# EAGLE design WN01 (EAGLE 6.3)
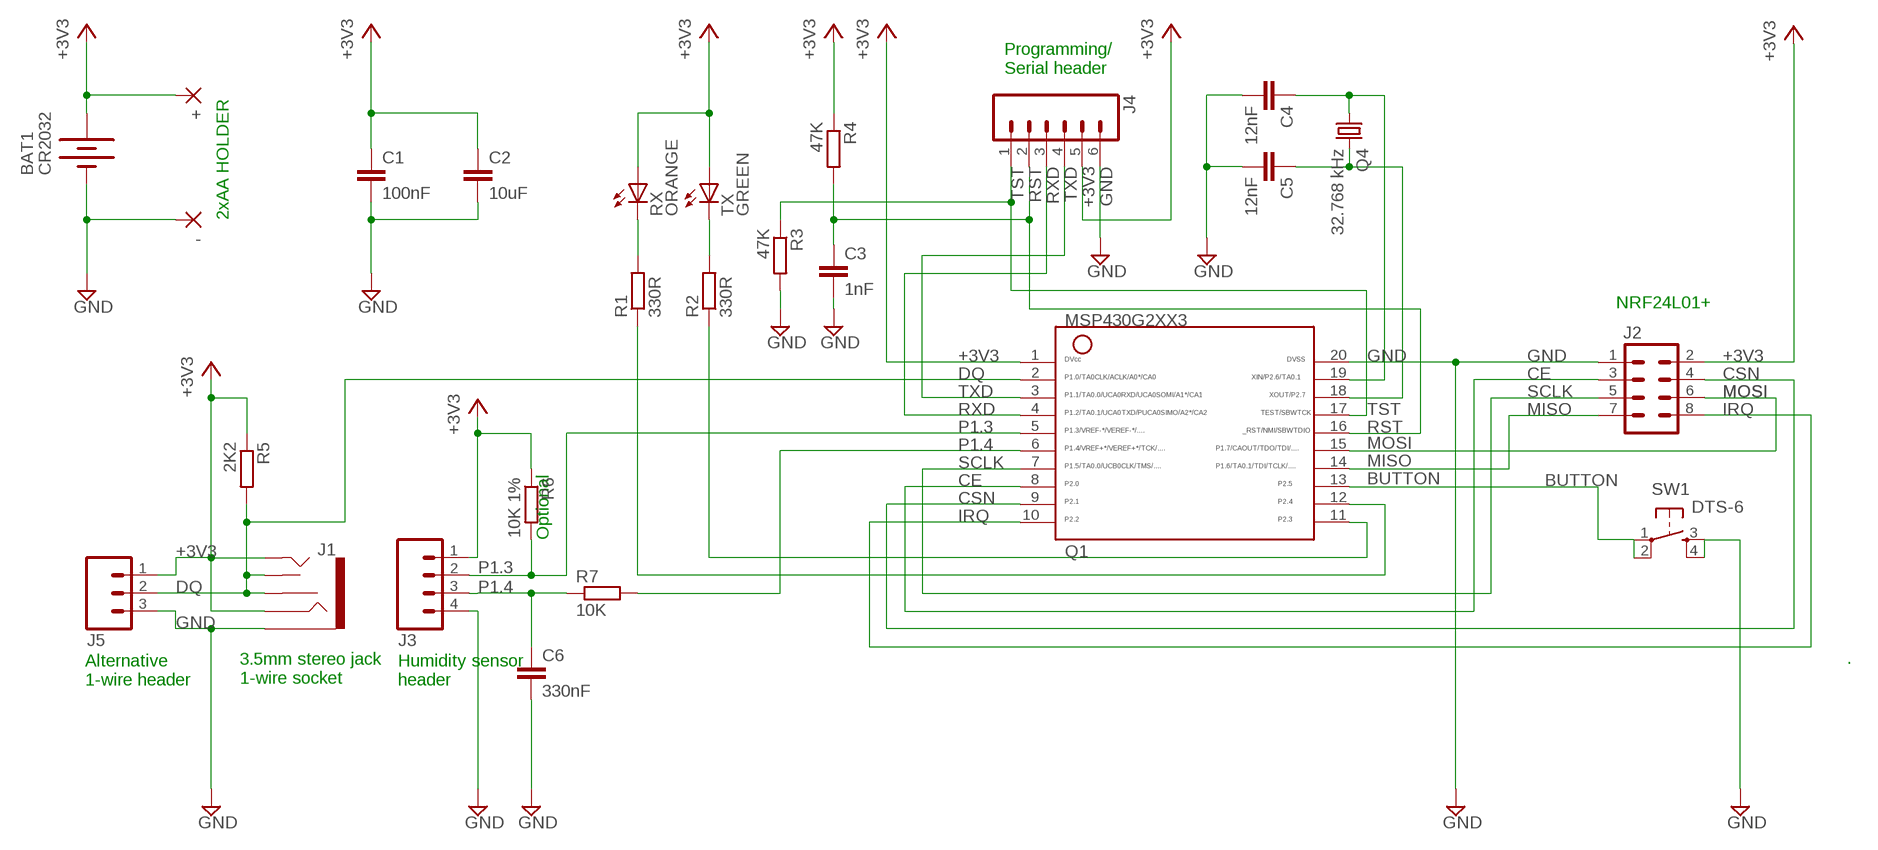
[diagram p0: schematic, sheet 1]

## Parts
+  2,54/1,0  [2,54/1,0]
-  2,54/1,0  [2,54/1,0]
BAT1  CR2032  BATTERY20PTH  [BATTCOM_20MM_PTH]
C1  100nF  C-EUC0805  [C0805]
C2  10uF  C-EUC1206  [C1206]
C3  1nF  C-EUC0805  [C0805]
C4  12nF  C-EUC0805  [C0805]
C5  12nF  C-EUC0805  [C0805]
C6  330nF  C-EUC0805  [C0805]
J1  AUDIO-JACK2PTH  [AUDIO-JACK]
J2  M04X2  [2X4]
J3  M04PTH  [1X04]
J4  M06SIP  [1X06]
J5  M03PTH  [1X03]
Q1  G2XX3---PW20  [PW20]
Q4  32.768 kHz  CRYSTALTC38H  [TC38H]
R1  330R  R-EU_M0805  [M0805]
R2  330R  R-EU_M0805  [M0805]
R3  47K  R-EU_M0805  [M0805]
R4  47K  R-EU_M0805  [M0805]
R5  2K2  R-EU_M0805  [M0805]
R6  10K 1%  R-EU_M0805  [M0805]
R7  10K  R-EU_M0805  [M0805]
RX  ORANGE  LEDCHIPLED_0805  [CHIPLED_0805]
SW1  DTS-6  [DTS-6]
TX  GREEN  LEDCHIPLED_0805  [CHIPLED_0805]

## Nets
+3V3: +.1(P) BAT1.1(+) C1.1 C2.1 J1.RING J1.TIP J2.2 J3.1 J4.5 J5.1 Q1.1 R4.1 R5.1 R6.1 RX.A TX.A
BUTTON: Q1.13 SW1.1 SW1.2
CE: J2.3 Q1.8
CSN: J2.4 Q1.9
DQ: J1.RSH J1.TSH J5.2 Q1.2 R5.2
GND: -.1(P) BAT1.2(-) C1.2 C2.2 C3.2 C4.2 C5.2 C6.2 J1.SLEEVE J2.1 J3.4 J4.6 J5.3 Q1.20 R3.2 SW1.3 SW1.4
IRQ: J2.8 Q1.10
MISO: J2.7 Q1.14
MOSI: J2.6 Q1.15
N$1: R2.2 TX.C
N$2: R1.2 RX.C
N$3: Q1.11 R2.1
N$5: Q1.12 R1.1
N$7: C6.1 J3.3 R7.1
P1.3: J3.2 Q1.5 R6.2
P1.4: Q1.6 R7.2
P2.6: C4.1 Q1.19 Q4.1
P2.7: C5.1 Q1.18 Q4.2
RST: C3.1 J4.2 Q1.16 R4.2
RXD: J4.3 Q1.4
SCLK: J2.5 Q1.7
TST: J4.1 Q1.17 R3.1
TXD: J4.4 Q1.3

## Notes on the sheet
- Programming/
  Serial header
- 2xAA HOLDER
- NRF24L01+
- Optional
- .
- 3.5mm stereo jack
  1-wire socket
- Alternative
  1-wire header
- Humidity sensor 
  header

## Library data of the parts
+ - = wirepad:2,54/1,0: THROUGH-HOLE PAD
BAT1 = SparkFun:BATTERY: Battery Holders Various common sizes : AA, AAA, 20mm coin cell and 12mm coin cell.
C1 C3-C6 = resistor:C-EU: CAPACITOR, European symbol
C2 = rcl:C-EU: CAPACITOR, European symbol
J1 = SparkFun-Connectors:AUDIO-JACK2: Stereo audio jack with bypass switches.
J2 = SparkFun:M04X2
J3 = SparkFun:M04: Header 4 Standard 4-pin 0.1" header. Use with straight break away headers (SKU : PRT-00116), right angle break away headers (PRT-00553), swiss pins (PRT-00743), machine pins (PRT-00117), and female headers (PRT-00115). Molex polarized connector foot print use with SKU : PRT-08231 with associated crimp pins and housings. 1MM SMD Version SKU: PRT-10208
J4 = SparkFun:M06: Header 6 Standard 6-pin 0.1" header. Use with straight break away headers (SKU : PRT-00116), right angle break away headers (PRT-00553), swiss pins (PRT-00743), machine pins (PRT-00117), and female headers (PRT-00115). Molex polarized connector foot print use with SKU : PRT-08094 with associated crimp pins and housings. NOTES ON THE VARIANTS LOCK and LOCK_LONGPADS... This footprint was designed to help hold the alignment of a through-hole component (i.e. 6-pin header) while soldering it into place. You may notice that each hole has been shifted either up or down by 0.005 of an inch from it's more standard position (which is a perfectly straight line). This slight alteration caused the pins (the squares in the middle) to touch the edges of the holes. Because they are alternating, it causes a "brace" to hold the component in place. 0.005 has proven to be the perfect amount of "off-center" position when using our standard breakaway headers. Although looks a little odd when you look at the bare footprint, once you have a header in there, the alteration is very hard to notice. Also, if you push a header all the way into place, it is covered up entirely on the bottom side. This idea of altering the position of holes to aid alignment will be further integrated into the Sparkfun Library for other footprints. It can help hold any component with 3 or more connection pins.
J5 = SparkFun:M03: Header 3 Standard 3-pin 0.1" header. Use with straight break away headers (SKU : PRT-00116), right angle break away headers (PRT-00553), swiss pins (PRT-00743), machine pins (PRT-00117), and female headers (PRT-00115). Molex polarized connector foot print use with SKU : PRT-08232 with associated crimp pins and housings.
Q1 = TI_MSP430_v16:G2XX3---PW20: MSP430G2XX1 TSSOP (PW) 20 Pin Package
Q4 = crystal:CRYSTAL: CRYSTAL; OC_FARNELL: unknown; OC_NEWARK: unknown
R1-R7 = resistor:R-EU_: RESISTOR, European symbol; RESISTANCE: 4K7
RX TX = led:LED: LED OSRAM: - CHIPLED LG R971, LG N971, LY N971, LG Q971, LY Q971, LO R971, LY R971 LH N974, LH R974 LS Q976, LO Q976, LY Q976 LO Q996 - Hyper CHIPLED LW Q18S LB Q993, LB Q99A, LB R99A - SideLED LS A670, LO A670, LY A670, LG A670, LP A670 LB A673, LV A673, LT A673, LW A673 LH A674 LY A675 LS A676, LA A676, LO A676, LY A676, LW A676 LS A679, LY A679, LG A679 - Hyper Micro SIDELED® LS Y876, LA Y876, LO Y876, LY Y876 LT Y87S - SmartLED LW L88C, LW L88S LB L89C, LB L89S, LG L890 LS L89K, LO L89K, LY L89K LS L896, LA L896, LO L896, LY L896 - TOPLED LS T670, LO T670, LY T670, LG T670, LP T670 LSG T670, LSP T670, LSY T670, LOP T670, LYG T670 LG T671, LOG T671, LSG T671 LB T673, LV T673, LT T673, LW T673 LH T674 LS T676, LA T676, LO T676, LY T676, LB T676, LH T676, LSB T676, LW T676 LB T67C, LV T67C, LT T67C, LS T67K, LO T67K, LY T67K, LW E67C LS E67B, LA E67B, LO E67B, LY E67B, LB E67C, LV E67C, LT E67C LW T67C LS T679, LY T679, LG T679 LS T770, LO T770, LY T770, LG T770, LP T770 LB T773, LV T773, LT T773, LW T773 LH T774 LS E675, LA E675, LY E675, LS T675 LS T776, LA T776, LO T776, LY T776, LB T776 LHGB T686 LT T68C, LB T68C - Hyper Mini TOPLED® LB M676 - Mini TOPLED Santana® LG M470 LS M47K, LO M47K, LY M47K Source: http://www.osram.convergy.de LUXEON: - LUMILED® LXK2-PW12-R00, LXK2-PW12-S00, LXK2-PW14-U00, LXK2-PW14-V00 LXK2-PM12-R00, LXK2-PM12-S00, LXK2-PM14-U00 LXK2-PE12-Q00, LXK2-PE12-R00, LXK2-PE12-S00, LXK2-PE14-T00, LXK2-PE14-U00 LXK2-PB12-K00, LXK2-PB12-L00, LXK2-PB12-M00, LXK2-PB14-N00, LXK2-PB14-P00, LXK2-PB14-Q00 LXK2-PR12-L00, LXK2-PR12-M00, LXK2-PR14-Q00, LXK2-PR14-R00 LXK2-PD12-Q00, LXK2-PD12-R00, LXK2-PD12-S00 LXK2-PH12-R00, LXK2-PH12-S00 LXK2-PL12-P00, LXK2-PL12-Q00, LXK2-PL12-R00 Source: www.luxeon.com KINGBRIGHT: KA-3528ASYC Source: www.kingbright.com
SW1 = switch-tact:DTS-6

## Board
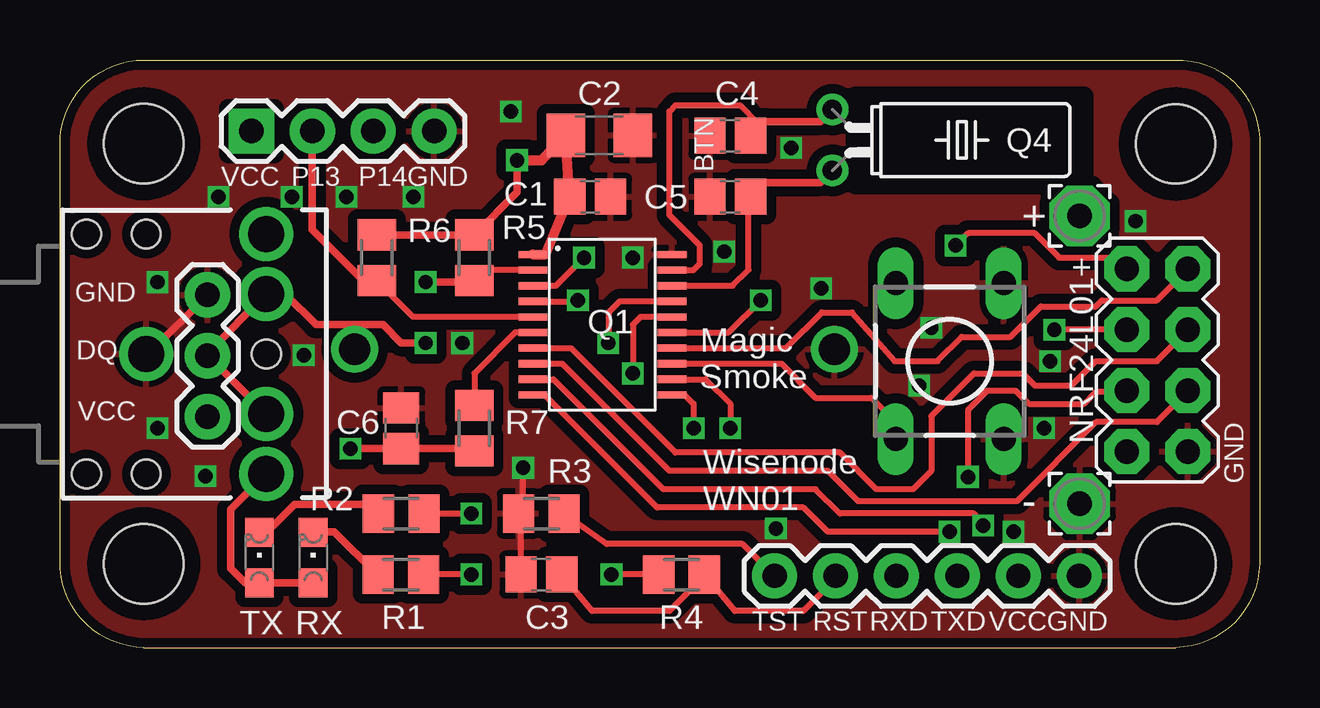
[diagram p1: board, top side]
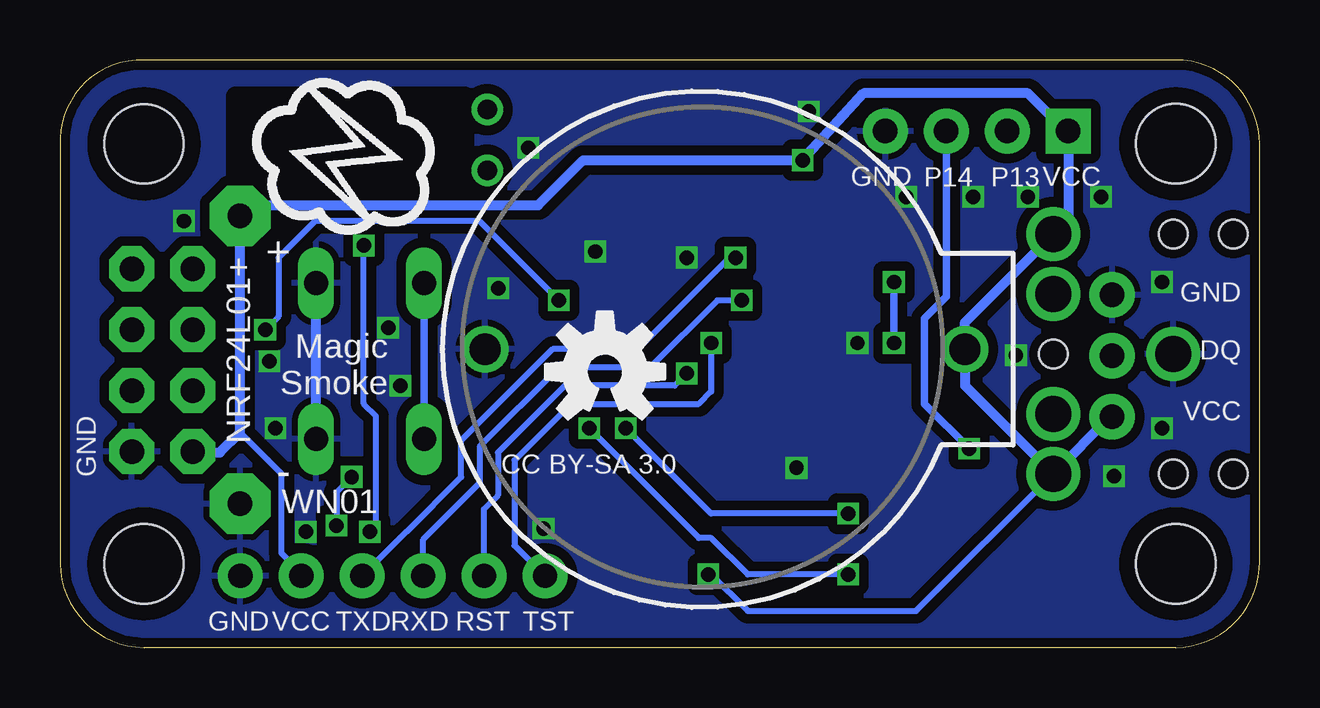
[diagram p2: board, bottom side, seen from below]

Size 50 x 24.5 mm. Coordinates in mm from the lower left corner, seen from the top.
Outline: 3.49,0 3.5,0
Outline: 3.5,0 46.5,0
Outline: 46.5,0 46.51,0
Outline: 0,3.49 0,3.6
Outline: 0,3.6 0,21
Outline: 0,21 0,21.01
Outline: 46.5,24.5 3.5,24.5 arc90 0,21
Outline: 46.5,24.5 46.51,24.5
Outline: 50,21.02 50,20.9
Outline: 50,20.9 50,3.5
Outline: 50,3.5 50,3.49
Outline: 3.5,0 arc-90 0,3.6
Outline: 46.5,24.5 arc-95 50,20.9
Outline: 50,3.5 arc-88 46.5,0
Copper layers (1*16): Top 0.035mm / dielectric 1.5mm / Bottom 0.035mm
Design rules "Fusion_eagle_rule_v1.1": minimum track width 6mil, minimum drill 12mil, track to track 6mil, track to pad 6mil, pad to pad 6mil, via to via 6mil, smd to smd 0mil, copper to edge 10mil, drill to drill 10mil, minimum pad ring 10mil, minimum via ring 6mil, stop-mask expansion 2mil, vias tented up to drill 100mil, thermal gap 10mil
tRestrict: area 33.1,19.3 to 42.7,23
bRestrict: area 33.1,19.3 to 42.7,23

### Footprints (pad centres in the part's own frame; a part is rotated, then mirrored left to right if it is on the bottom)
2,54/1,0 = drill 1.016 pad 2.54 octagon: 1 0,0
BATTCOM_20MM_PTH = drill 1.3: 1 20,0; 2 0,0
C0805 = smd 1.3 x 1.5: 1 -0.85,0; 2 0.85,0
C1206 = smd 1.6 x 1.8: 1 -1.4,0; 2 1.4,0
AUDIO-JACK = drill 1.5 pad 2.184: RING 5,5; RSH 5,2.5; SLEEVE 0,0; TIP 5,-5; TSH 5,-2.5 | hole 1.2: 0,5; -2.5,5; -2.5,-5; 0,-5; 5,0
2X4 = drill 1.016 pad 1.88 octagon: 1 -3.81,-1.27; 2 -3.81,1.27; 3 -1.27,-1.27; 4 -1.27,1.27; 5 1.27,-1.27; 6 1.27,1.27; 7 3.81,-1.27; 8 3.81,1.27
1X04 = drill 1.016 pad 1.88 square: 1 0,0 | drill 1.016 pad 1.88: 2 2.54,0; 3 5.08,0; 4 7.62,0
1X06 = drill 1.016 pad 1.88: 1 0,0; 2 2.54,0; 3 5.08,0; 4 7.62,0; 5 10.16,0; 6 12.7,0
1X03 = drill 1.016 pad 1.88: 1 0,0; 2 2.54,0; 3 5.08,0
PW20 = smd 0.3 x 1.2: 1 -2.925,-2.9; 2 -2.275,-2.9; 3 -1.625,-2.9; 4 -0.975,-2.9; 5 -0.325,-2.9; 6 0.325,-2.9; 7 0.975,-2.9; 8 1.625,-2.9; 9 2.275,-2.9; 10 2.925,-2.9; 11 2.925,2.9; 12 2.275,2.9; 13 1.625,2.9; 14 0.975,2.9; 15 0.325,2.9; 16 -0.325,2.9; 17 -0.975,2.9; 18 -1.625,2.9; 19 -2.275,2.9; 20 -2.925,2.9
TC38H = drill 0.813: 1 -1.27,0; 2 1.27,0
M0805 = smd 1.3 x 1.6: 1 -0.95,0; 2 0.95,0
CHIPLED_0805 = smd 1.2 x 1.2: A 0,-1.05; C 0,1.05
DTS-6 = drill 1 long: 1 -3.25,2.25; 2 3.25,2.25; 3 -3.25,-2.25; 4 3.25,-2.25
STAND-OFF = hole 3.302: 0,0

### Placement (x,y rotation side)
+  42.5,18 0 top
-  42.5,6 0 top
BAT1  32.28,12.44 0 bottom
C1  22.1,18.8 0 top
C2  22.48,21.36 0 top
C3  20.07,3.05 180 top
C4  27.94,21.34 180 top
C5  27.94,18.8 180 top
C6  14.22,9.14 90 top
J1  3.6,12.24 0 top
J2  45.74,11.98 90 top
J3  7.98,21.54 0 top
J4  29.79,2.99 0 top
J5  6.15,9.63 90 top
Q1  22.61,13.46 270 top
Q4  32.2,21.16 270 top
R1  14.21,3.05 180 top
R2  14.22,5.59 180 top
R3  20.07,5.59 180 top
R4  25.91,3.05 0 top
R5  17.27,16.26 270 top
R6  13.21,16.26 270 top
R7  17.27,9.14 90 top
RX  10.56,3.75 0 top
SW1  37.08,11.94 90 top
TX  8.31,3.75 0 top
U$1  [OSHW-LOGO-M]  27.29,11.5 0 bottom
U$2  [STAND-OFF]  46.51,3.49 0 top
U$3  [STAND-OFF]  3.49,3.49 0 top
U$4  [STAND-OFF]  3.49,21.01 0 top
U$5  [STAND-OFF]  46.5,21 0 top

### Tracks (layer width: path | path; a pad name or v marks a point on that pad's centre or on a via)
+3V3  (via drill 0.6)
  Top 0.254: R4.1 v22.99,3.05
  Top 0.305: J1.TIP 8.53,7.24 | RX.A TX.A 7.71,2.7 7.11,3.3 7.11,5.75 J1.TIP | J1.TIP 8.6,7.33 | R6.1 R5.1 19.05,18.98 v19.05,20.32
  Top 0.406: v19.05,20.32 20.08,20.32 C2.1 C1.1 20.23,16.39 Q1.1
  Bottom 0.254: v22.99,3.05 22.86,3.05 21.34,1.52 14.32,1.52 J1.TIP | J4.5 39.95,3.12 40.77,3.94 40.77,7.24 42.5,8.97
  Bottom 0.406: 8.48,17.36 J1.RING | J5.1 6.21,9.63 J1.TIP 12.28,10.92 BAT1.1 12.28,13.56 J1.RING | J2.2 44.42,8.13 43.34,8.13 42.5,8.97 +.1 42.06,18.44 30.08,18.44 28.19,20.32 v19.05,20.32 16.51,23.11 9.65,23.11 8.08,21.54 J3.1 7.98,17.86 J1.RING
BUTTON
  Top 0.254: Q1.13 30.07,11.84 31.5,10.41 33.82,10.41 34.83,9.4 SW1.1 | 34.83,13.97 SW1.2
  Bottom 0.305: SW1.2 SW1.1
CE
  Top 0.254: J2.3 47.01,10.69 45.72,9.4 43.18,9.4 39.88,6.1 33.27,6.1 32,7.37 25.4,7.37 20.93,11.84 Q1.8
CSN  (via drill 0.6)
  Top 0.254: Q1.9 20.56,11.19 25.15,6.6 31.5,6.6 32.51,5.59 38.1,5.59 v38.48,5.08 | v37.85,7.11 37.85,9.91 38.65,10.71 39.83,10.71 40.39,10.16 42.67,10.16 43.18,10.67 44.42,10.67 J2.4
  Bottom 0.254: v37.85,7.11 38.48,6.48 v38.48,5.08
DQ  (via drill 0.6)
  Top 0.254: Q1.2 17.7,15.74 R5.2
  Top 0.305: 8.72,9.74 J1.TSH 6.17,12.17 J5.2 6.15,12.29 J1.RSH 9.39,14.74 10.67,13.46 13.46,13.46 14.22,12.7 v15.24,12.7 | v15.24,15.24 17.21,15.24 R5.2
  Bottom 0.305: v15.24,12.7 v15.24,15.24
GND  (via drill 0.6)
  Top 0.254: C3.2 19.22,5.74 R3.2 19.3,5.59 v19.3,7.49
  Top 0.305: J1.SLEEVE 3.68,12.24 J5.3
  Bottom 0.305: 39.37,8.65 SW1.3
  Bottom 0.406: SW1.3 SW1.4
  other vias: 4.06,9.14 4.06,15.24 10.16,12.19 31.73,14.98 23.88,16.26 16.76,12.7 27.69,16.51 6.6,18.8 35.81,10.92 36.32,13.34 14.73,18.8 11.94,18.8 9.66,18.8 30.48,20.83 44.83,17.78 29.84,4.95 18.8,22.35 41.27,11.94 41.02,9.14 6.06,7.14 39.75,4.83
  pour Top (isolate 0.406): 51.05,25.91 51.05,-1.02 -1.02,-1.02 -1.02,25.65
  pour Bottom (isolate 0.406): -0.51,25.15 43.18,25.15 50.55,25.15 50.55,-0.51 -0.51,-0.51
IRQ  (via drill 0.6)
  Top 0.254: v37.34,16.76 37.85,17.27 40.64,17.27 41.66,16.26 44.01,16.26 J2.8 | v37.08,4.83 32,4.83 30.99,5.84 24.89,5.84 20.2,10.54 Q1.10
  Bottom 0.254: v37.08,4.83 36.83,5.08 36.83,9.65 37.34,10.16 v37.34,16.76
MISO
  Top 0.254: J2.7 47.01,15.77 45.72,14.48 43.43,14.48 43.18,14.22 40.89,14.22 39.62,12.95 37.59,12.95 36.58,11.94 34.8,11.94 33.02,13.97 31.75,13.97 30.27,12.49 Q1.14
MOSI  (via drill 0.6)
  Top 0.254: J2.6 v41.45,13.25 | Q1.15 27.87,13.14 v29.21,14.48
  Bottom 0.254: v29.21,14.48 32.51,17.78 39.37,17.78 40.89,16.26 40.89,13.81 v41.45,13.25
N$1
  Top 0.305: TX.C 8.59,5.08 8.89,5.08 9.79,5.98 13.79,5.98 R2.2
N$2
  Top 0.305: R1.2 13.21,3.05 11.43,4.83 10.58,4.83 RX.C
N$3  (via drill 0.6)
  Top 0.254: Q1.11 26.04,10.54 26.42,10.16 v26.42,9.14 | R2.1 v17.14,5.59
  Bottom 0.254: v17.14,5.59 22.86,5.59 v26.42,9.14
N$5  (via drill 0.6)
  Top 0.254: v17.14,3.05 15.67,3.05 R1.1 | Q1.12 26.91,11.19 27.94,10.16 v27.94,9.14
  Bottom 0.254: v17.14,3.05 21.34,3.05 22.86,4.57 23.37,4.57 v27.94,9.14
N$7  (via drill 0.6)
  Top 0.305: R7.1 17.17,8.29 C6.1 v12.1,8.29
  Bottom 0.305: v12.1,8.29 13.97,10.16 13.97,13.72 13.06,14.63 J3.3
P1.3
  Top 0.254: Q1.5 14.73,13.79 R6.2
  Top 0.305: R6.2 13.4,15.24 12.7,15.24 10.52,17.42 J3.2
P1.4
  Top 0.254: Q1.6 18.98,13.14 17.27,11.43 R7.2
P2.6
  Top 0.254: Q1.19 26.41,15.74 26.67,16 26.67,16.76 25.4,18.03 25.4,22.35 25.65,22.61 28.36,22.61 29.1,21.87
  Top 0.305: C4.1 29.1,21.87 29.13,21.93 31.7,21.93 Q4.1
P2.7
  Top 0.254: 28.7,18.71 28.7,15.75 28.04,15.09 Q1.18
  Top 0.305: 28.7,18.71 C5.1 29.13,19.39 31.7,19.39 Q4.2
RST  (via drill 0.6)
  Top 0.254: Q1.16 24.2,13.79 23.88,13.46 v23.88,11.43 | J4.2 32.33,2.86 30.99,1.52 28.13,1.52 R4.2 26.6,2.73 25.4,1.52 22.19,1.52 C3.1
  Bottom 0.254: v23.88,11.43 24.38,10.92 28.96,10.92 31.75,8.13 31.75,6.35 32.33,5.77 J4.2
RXD  (via drill 0.6)
  Top 0.254: Q1.4 21.8,14.44 v21.59,14.48
  Bottom 0.254: v21.59,14.48 22.61,14.48 25.4,11.68 29.21,11.68 32.51,8.38 32.51,6.86 34.87,4.5 J4.3
SCLK
  Top 0.254: J2.5 47.01,13.23 45.72,11.94 43.18,11.94 42.16,10.92 40.64,10.92 40.13,11.43 38.1,11.43 36.32,9.65 36.32,7.37 35.56,6.6 34.04,6.6 32.51,8.13 25.65,8.13 21.3,12.49 Q1.7
TST  (via drill 0.6)
  Top 0.254: Q1.17 23.33,14.44 22.86,13.97 v22.86,12.7 | J4.1 28.45,4.32 22.79,4.32 R3.1
  Bottom 0.254: v22.86,12.7 22.86,10.67 23.37,10.16 28.7,10.16 31.06,7.81 31.06,4.26 J4.1
TXD  (via drill 0.6)
  Top 0.254: Q1.3 20.68,15.09 v21.84,16.26
  Bottom 0.254: J4.4 35.57,4.83 35.56,4.83 33.27,7.11 33.27,8.64 29.46,12.45 25.91,12.45 22.1,16.26 v21.84,16.26

### Text on the board
tPlace: Magic / Smoke | Wisenode / WN01
bPlace: Magic / Smoke | CC BY-SA 3.0 | WN01
tNames: BTN | VCC | P13 | P14 | GND | NRF24L01+ | GND | DQ | VCC | GND | TST | RST | RXD | TXD | VCC | GND
bNames: VCC | P13 | P14 | GND | + | NRF24L01+ | GND | DQ | VCC | - | GND | TST | RST | RXD | TXD | VCC | GND | +